# Altium schematic sheet Motor Controller.SchDoc
size A4
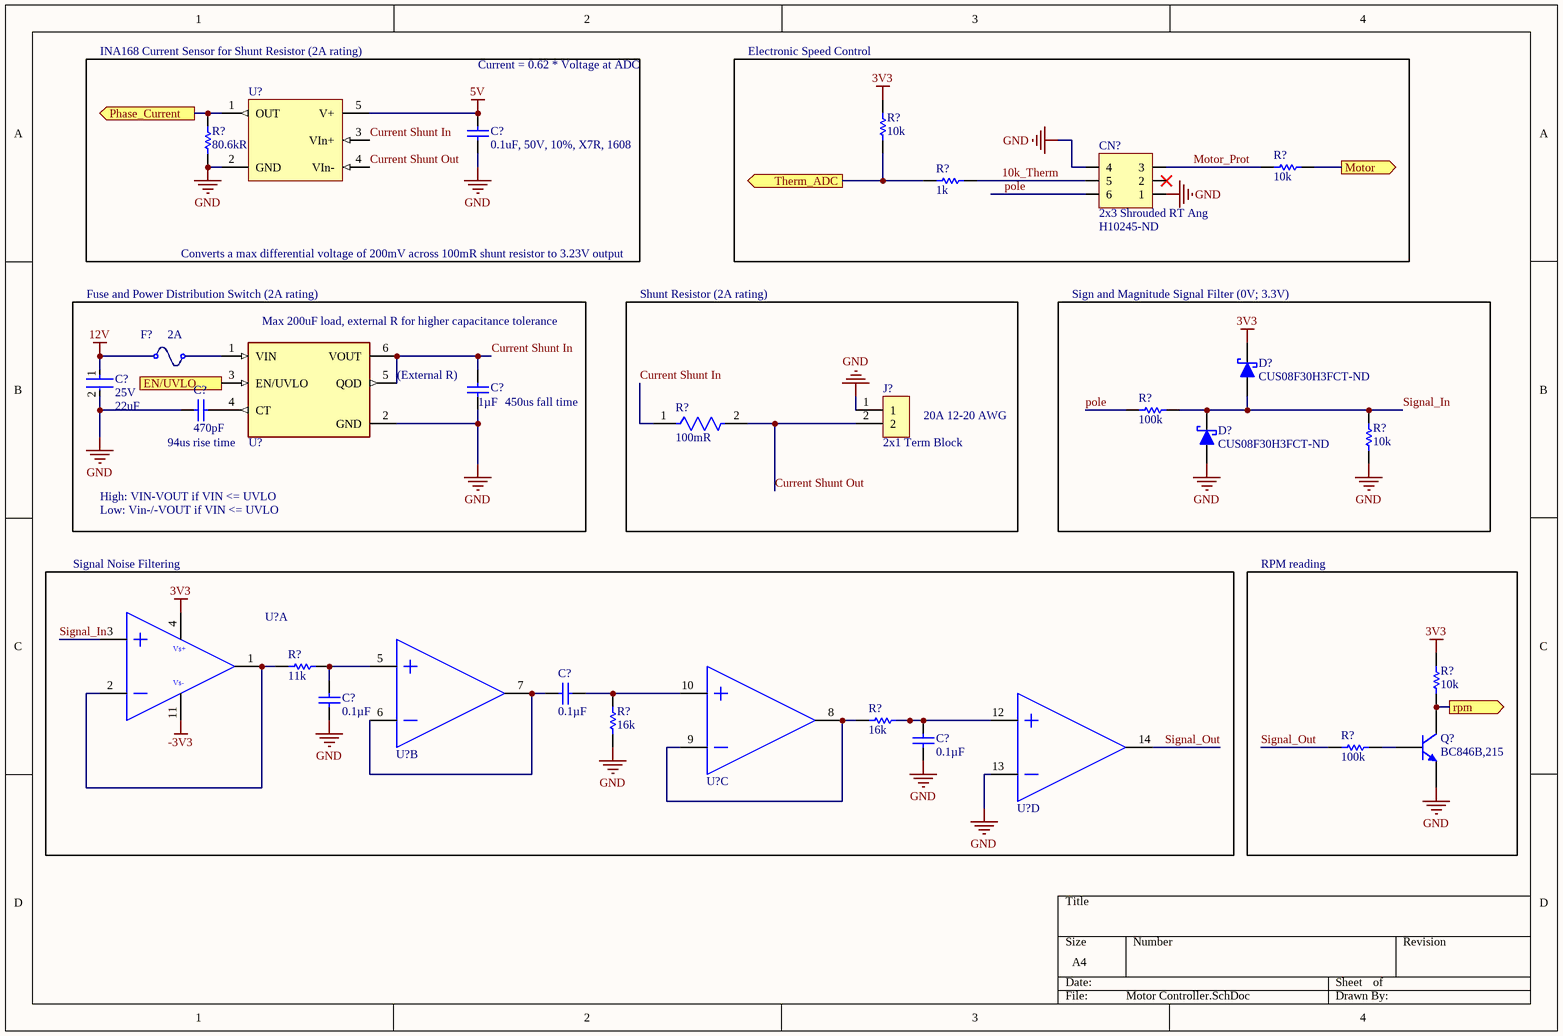
[diagram p0: Motor Controller.SchDoc]

## Parts
(Parts that share a designator on the sheet are numbered #1, #2 ... from top to bottom, then left to right.)
C?#1  0.1uF, 50V, 10%, X7R, 1608  [CAPC1608N(0603")]
C?#2  Voltage: 25V  Capacitance: 22uF  [FP-GRM32-IPC_A]  (hidden comment: GRM32ER71E226ME15K)
C?#3  value 470pF  [CAPC1608N(0603")]  (hidden comment: 470pF 50V 0603 SMD, Ceramic)
C?#4  value 1µF  [CAPC1608N(0603")]  (hidden comment: 1uF 50V 0603 SMD, Ceramic)
C?#5  Capacitance: 0.1µF  [CAPC1608N(0603")]  (hidden comment: 0.1uF, 50V, 10%, X7R, 1608)
C?#6  Capacitance: 0.1µF  [CAPC1608N(0603")]  (hidden comment: 0.1uF, 50V, 10%, X7R, 1608)
C?#7  Capacitance: 0.1µF  [CAPC1608N(0603")]  (hidden comment: 0.1uF, 50V, 10%, X7R, 1608)
CN?  2x3 Shrouded RT Ang  Supplier Part Number 1: H10245-ND  [HEADER, MALE, Shrouded, 6POS, 2MM, RT ANG,THT]
D?#1  CUS08F30H3FCT-ND  [SC-76]
D?#2  CUS08F30H3FCT-ND  [SC-76]
F?  Current Rating: 2A  [RESC1206(3216)]  (hidden comment: SMD Fuse, 2A, 63VAC, Slow Blow)
J?  2x1 Term Block  [2X1 Terminal Blocks Phoenix Contact 5mm]
Q?  BC846B,215  [SOT-23]
R?#1  10k  [RESC1608N(0603")]
R?#2  Resistance: 80.6kR  [RESC0603(1608)_M]  (hidden comment: 80.6kR, 1%, 1/10W, 0603)
R?#3  1k  [RESC1608N(0603")]
R?#4  10k  [RESC1608N(0603")]
R?#5  Resistance: 100mR  [FP-RL2512-MFG]  (hidden comment: RL2512FK-070R1L)
R?#6  100k  [RESC1608N(0603")]
R?#7  10k  [RESC1608N(0603")]
R?#8  11k  [RESC1608N(0603")]
R?#9  10k  [RESC1608N(0603")]
R?#10  16k  [RESC1608N(0603")]
R?#11  16k  [RESC1608N(0603")]
R?#12  100k  [RESC1608N(0603")]
U?#1  INA168, Current Sensor, High-Side, Analog  [SOT23-5]  (value not drawn)
U?#2  TPS22810DBVT  [FP-DBV0006A-IPC_B]  (value not drawn)
U?#3  Quad Op Amp TSV324  [SOP-14]  (value not drawn)  (part A of 4)
U?#4  Quad Op Amp TSV324  [SOP-14]  (value not drawn)  (part B of 4)
U?#5  Quad Op Amp TSV324  [SOP-14]  (value not drawn)  (part C of 4)
U?#6  Quad Op Amp TSV324  [SOP-14]  (value not drawn)  (part D of 4)

## Blocks framed on the sheet
Electronic Speed Control: CN? R?#1 R?#3 R?#4
Sign and Magnitude Signal Filter (0V; 3.3V): D?#1 D?#2 R?#6 R?#7
Signal Noise Filtering: C?#5-C?#7 R?#8 R?#10 R?#11 U?#3-U?#6
RPM reading: Q? R?#9 R?#12

## Ports
EN/UVLO (in), Motor (out), Phase_Current (out), rpm (out), Therm_ADC (out)

## Nets
3V3: D?#1.K(Cathode) R?#1.2 R?#9.2 U?#3.4(Vcc+)
5V: C?#1.2(Cathode) U?#1.5(V+)
12V: C?#2.1 F?.1
-3V3: U?#3.11(Vcc-)
GND: C?#1.1(Anode) C?#2.2 C?#3.1 C?#4.1(Anode) C?#6.1(Anode) C?#7.1(Anode) CN?.1 CN?.4 D?#2.A(Anode) J?.1 Q?.2(E) R?#2.1 R?#7.1 R?#10.1 U?#1.2(GND) U?#2.2(GND) U?#6.13(Inverting_Input_3)
10k_Therm: CN?.5 R?#3.2
Current Shunt In: C?#4.2(Cathode) R?#5.1 U?#1.3(VIn+) U?#2.5(QOD) U?#2.6(VOUT)
Current Shunt Out: J?.2 R?#5.2 U?#1.4(VIn-)
EN/UVLO: U?#2.3(EN/UVLO) ; port EN/UVLO
Motor: R?#4.1 ; port Motor
Motor_Prot: CN?.3 R?#4.2
Phase_Current: R?#2.2 U?#1.1(OUT) ; port Phase_Current
pole: CN?.6 R?#6.2
rpm: Q?.3(C) R?#9.1 ; port rpm
Signal_In: D?#1.A(Anode) D?#2.K(Cathode) R?#6.1 R?#7.2 U?#3.3(Non-Inverting_Input_1)
Signal_Out: R?#12.1 U?#6.14(Output_4)
Therm_ADC: R?#1.1 R?#3.1 ; port Therm_ADC
NetC?#3_2: C?#3.2 U?#2.4(CT)
NetC?#5_1: C?#5.1(Anode) U?#4.6(Inverting_Input_2) U?#4.7(Output_2)
NetC?#5_2: C?#5.2(Cathode) R?#10.2 U?#5.10(Non-Inverting_Input_3)
NetC?#6_2: C?#6.2(Cathode) R?#8.2 U?#4.5(Non-Inverting_Input_2)
NetC?#7_2: C?#7.2(Cathode) R?#11.1 U?#6.12(Non-Inverting_Input_4)
NetF?_2: F?.2 U?#2.1(VIN)
NetQ?_1: Q?.1(B) R?#12.2
NetR?#8_1: R?#8.1 U?#3.1(Output_1) U?#3.2(Inverting_Input_1)
NetR?#11_2: R?#11.2 U?#5.8(Output_3) U?#5.9(Inverting_Input_3)

Not connected (* = marked no-connect by the designer): CN? 2*

## Notes on the sheet
- INA168 Current Sensor for Shunt Resistor (2A rating)
- Current = 0.62 * Voltage at ADC
- Fuse and Power Distribution Switch (2A rating)
- Converts a max differential voltage of 200mV across 100mR shunt resistor to 3.23V output
- Shunt Resistor (2A rating)
- (near U?#2) Max 200uF load, external R for higher capacitance tolerance
- (near C?#4) (External R)
- (near U?#2) 94us rise time
- (near C?#4) 450us fall time
- (near J?) 20A 12-20 AWG
- High: VIN-VOUT if VIN <= UVLO
- Low: Vin-/-VOUT if VIN <= UVLO
- (in symbol Quad Op Amp TSV324, part A) Vs+; Vs-

## Library data of the parts
C?#1 = CMP-006-0008-1: CAP CER 0.1UF 50V 10% X7R 1608 (0603); Manufacturer: Samsung Electro-Mechanics America, Inc; Manufacturer Part Number: CL10B104KB8SFNC; Capacitance: 0.1µF; Size / Dimension: 0.063" L x 0.031" W (1.60mm x 0.80mm); Design Item ID: 0.1uF, 50V, 10%, X7R, 1608; RoHS: RoHS Compliant; Package / Case: 0603 (1608 Metric); Packaging: Cut Tape (CT); Height - Seated (Max): -; Component Type: Standard; Source: AUVic_Schematic_Library_Capacitors.SchLib; ComponentLink1URL: http://www.samsungsem.com/servlet/FileDownload?type=spec&file=CL10B104KB8SFNC.pdf; Tolerance: ±10%; Operating Temperature: -55°C ~ 125°C; Mounting Type: Surface Mount, MLCC; Features: Soft Termination; Lead Style: -; Pin Count: 2; Temperature Coefficient: X7R; Applications: Boardflex Sensitive; Voltage - Rated: 50V; Ratings: -; ComponentLink1Description: http://www.samsungsem.com/servlet/FileDownload?type=spec&file=CL10B104KB8SFNC.pdf; Thickness (Max): 0.035" (0.90mm); Stock 1: 743572; Category: Capacitors; Lead Spacing: -; Pricing 1: 1=0.12, 10=0.033, 25=0.0232, 100=0.0152, 500=0.01064, 1000=0.00829 (CAD)
C?#2 = CMP-00040-2: CAP CER 22UF 25V X7R 1210; Tolerance: 20%; Weight: 0.00388oz; Case/Package: 1210; Min Operating Temperature: -55°C; Voltage Rating: 25V; Height: 2.5mm; Case Code (Metric): 3225; Max Operating Temperature: 125°C; Width: 0.098inch; Mount: Surface Mount; Termination: SMD/SMT; Package Quantity: 4000; Voltage Rating (DC): 25V; Packaging: Tape and Reel; Composition: Ceramic; Thickness: 0.106inch; Length: 0.126inch; Case Code (Imperial): 1210; Dielectric: X7R
C?#3 = CMP-006-0049-1: Capacitor, Ceramic, 50V, +/- 10%, 0603 SMD, X7R; Published: May 11, 2010; Publisher: TRAXX Automation Ltd.; Pin Count: 2; LatestRevisionDate: May 11, 2010; Source: AUVic_Schematic_Library_Capacitors.SchLib; Component Type: Standard; PackageDescription: Chip Capacitor; Design Item ID: 470pF 50V 0603 SMD, Ceramic
C?#4 = CMP-006-0028-1: Capacitor, Ceramic, 50V, +/- 10%, 0603 SMD, X5R; Design Item ID: 1uF 50V 0603 SMD, Ceramic; Created By: Lyden Smith; PackageDescription: Chip Capacitor; Source: AUVic_Schematic_Library_Capacitors.SchLib; Date Created: 2017-10-26; Pin Count: 2; Component Type: Standard
C?#5-C?#7 = 0.1uF, 50V, 10%, X7R, 1608: CAP CER 0.1UF 50V 10% X7R 1608 (0603); Manufacturer: Samsung Electro-Mechanics America, Inc; Manufacturer Part Number: CL10B104KB8SFNC; Supplier 1: Digi-Key; RoHS: RoHS Compliant; Category: Capacitors; Stock 1: 743572; Pricing 1: 1=0.12, 10=0.033, 25=0.0232, 100=0.0152, 500=0.01064, 1000=0.00829 (CAD); Packaging: Cut Tape (CT); Tolerance: ±10%; Voltage - Rated: 50V; Temperature Coefficient: X7R; Mounting Type: Surface Mount, MLCC; Operating Temperature: -55°C ~ 125°C; Applications: Boardflex Sensitive; Ratings: -; Package / Case: 0603 (1608 Metric); Size / Dimension: 0.063" L x 0.031" W (1.60mm x 0.80mm); Height - Seated (Max): -; Thickness (Max): 0.035" (0.90mm); Lead Spacing: -; Features: Soft Termination; Lead Style: -; ComponentLink1URL: http://www.samsungsem.com/servlet/FileDownload?type=spec&file=CL10B104KB8SFNC.pdf; ComponentLink1Description: http://www.samsungsem.com/servlet/FileDownload?type=spec&file=CL10B104KB8SFNC.pdf; Supplier Part Number 1: 1276-1936-1-ND
CN? = Header, Male, 2x3 Conn, Shrouded, THT, 2MM RT ANG TIN: Header, Male, 2x3, Pitch: 0.1" (2.54mm), THT; Publisher: AUVic; Date Published: 2017-09-13; Last Updated: *; Reviewed By: *; Created By: Andy Bates; Supplier 1: Digi-Key
D?#1 D?#2 = CUS08F30H3FCT-ND: Diode, Schottky, 30V, 800mA; Created By: Andy Bates; Publisher: AUVic; Date Created: 2016-09-09; Supplier 1: Digi-Key; Supplier Part Number 1: CUS08F30H3FCT-ND
F? = CMP-00009-1: Fuse, Smd, 2A, Slow Blow, 1206; Fuse Type: Board Mount (Cartridge Style Excluded); Approvals: CE,cURus; Voltage Rating (AC): 63V; DC Cold Resistance: 123mR; Case Code (Metric): 3216; Min Operating Temperature: -55°C; Case/Package: 1206; Max Operating Temperature: 125°C; Mount: Surface Mount; Voltage Rating (DC): 63V; Case Code (Imperial): 1206; Packaging: Tape and Reel
J? = 2x1 Terminal Block, 20A, 12-20AWG: Made by: Andy Bates; Date Made: 2017-11-14; Supplier 1: Digi-Key; Supplier Part Number 1: 277-6405-ND
Q? = BC846B,215: NPN 65V 100mA 250mW; Published: 8-Jun-2000; LatestRevisionDate: 09-Sep-2016; DatasheetVersion: 1997; Publisher: Andy Bates; Supplier 1: Digi-Key; Supplier Part Number 1: 568-1632-1-ND
R?#1 R?#4 R?#7 R?#9 = 10kR, 1%, 1/10W, 0603 SMD: Made By: Ashwin Sira; Owned By: AUVic; Created On: 14-05-31; Last Edited: 14-05-31; Supplier 1: Digi-Key; Supplier Part Number 1: 311-10.0KHRCT-ND; Value: 10k
R?#2 = CMP-00098-1: Res Thick Film 0603 80.6K Ohm 1% 0.1W(1/10W) ±100ppm/C Molded SMD Automotive Paper T/R; Working Voltage: 75V; Temperature Coefficient: 100ppm/°C; Power Rating: 100mW; Termination: SMD/SMT; Radiation Hardening: No; Features: Automotive AEC-Q200; Number of Terminations: 2; Weight: 7.1E-05oz; Min Operating Temperature: -55°C; Tolerance: 1%; Lead Free: Lead Free; REACH SVHC: Unknown; Case Code (Imperial): 0603; Case/Package: 0603; Height: 0.45mm; Case Code (Metric): 1608; Depth: 0.85mm; Max Power Dissipation: 100mW; Resistor Type: Thick Film; Width: 0.033inch; Military Standard: Not; Voltage Rating (DC): 75V; Length: 1.55mm; Max Operating Temperature: 155°C; Contact Plating: Tin; Package Quantity: 10; Packaging: Tape and Reel; Voltage Rating: 75V
R?#3 = 1kR, 1%, 1/10W , 0603, SMD: Created By: Andy Bates; Publisher: AUVic; Date Created: 2017-05-10; Value: 1k; Supplier 1: Digikey; Supplier Part Number 1: 311-1.00KHRCT-ND
R?#5 = CMP-00128-1: Res Thick Film 2512 0.1 Ohm 1% 1W 600ppm/ C Molded SMD Embossed T/R; Tolerance: 5%; Voltage Rating: 500V; Temperature Coefficient: 600ppm/°C; Features: Moisture Resistant; Height: 0.026inch; Resistor Type: Thick Film; Resistance Tolerance: 1%; Termination: SMD/SMT; Width: 0.126inch; Case Code (Metric): 6432; Number of Terminations: 2; Size Code: 2512; Series: RL; Max Power Dissipation: 1W; Contact Plating: Tin,Lead; Max Operating Temperature: 155°C; Power Rating: 1W; Min Operating Temperature: -55°C; Lead Free: Lead Free; Package Quantity: 4000; REACH SVHC: Unknown; Length: 0.25inch; Packaging: Tape and Reel; Case Code (Imperial): 2512; Case/Package: 2512
R?#6 R?#12 = 100kR, 1%, 1/10W, 0603 SMD: Made By: Andy Bates; Owned By: AUVic; Created On: 14-06-30; Last Edited: 14-06-30; Value: 100k; Supplier 1: Digi-Key; Supplier Part Number 1: 311-100KGRCT-ND
R?#8 = 11kR, 1%, 1/10W, 0603 SMD: Made By: Ashwin Sira; Owned By: AUVic; Created On: 14-05-31; Last Edited: 14-05-31; Value: 11k; Supplier 1: Digi-Key; Supplier Part Number 1: 311-11.0KHRCT-ND
R?#10 R?#11 = 16kR, 1%, 1/10W, 0603 SMD: Made By: Ashwin Sira; Owned By: AUVic; Created On: 14-05-31; Last Edited: 14-05-31; Supplier 1: Digi-Key; Value: 16k; Supplier Part Number 1: 311-16.0KHRCT-ND
U?#1 = CMP-048-0001-2: Source: AUVic_Schematic_Library_Sensors.SchLib; Component Type: Standard; Pin Count: 5; Created By: Jacob Lower; Design Item ID: INA168, Current Sensor, High-Side, Analog; Created on: 2016-03-16; Publisher: AUVic
U?#2 = CMP-00127-1: TEXAS INSTRUMENTS - TPS22810DBVT - POWER LOAD SWITCH, 18V, SOT-23-6; Max Output Current: 2A; Number of Outputs: 1; Output Configuration: High Side; Interface: On/Off; Fault Protection: Over Temperature; Min Operating Temperature: -40°C; Packaging: Cut Tape; Max Operating Temperature: 105°C; Case/Package: SOT-23-6; Number of Channels: 1
U?#3-U?#6 = Quad Op Amp TSV324: TSV324; LatestRevisionNote: Re-released for DXP Platform.; Publisher: Altium Limited; Created By: Jordan; Creation Date: 10/14/2016; Supplier: Digikey; Supplier Part Number: 497-8198-2-ND